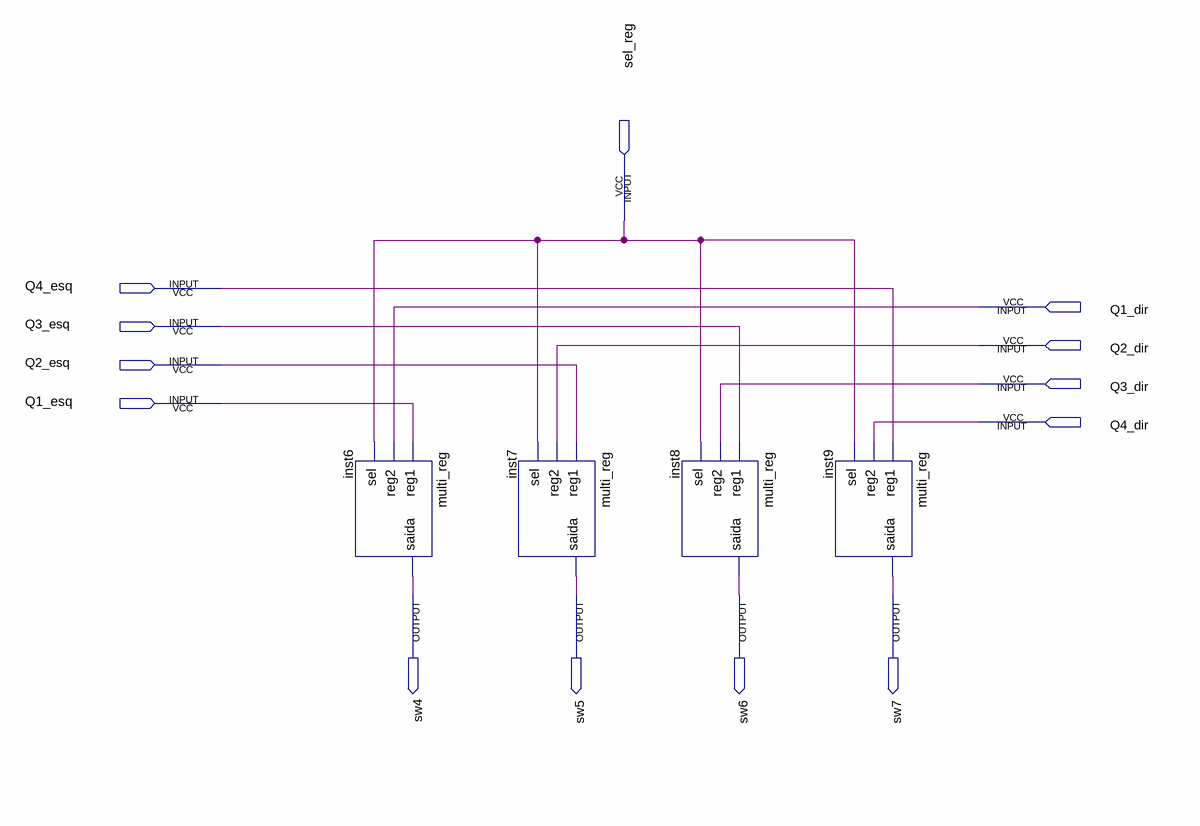
[diagram p0: schematic sheet]
// Quartus schematic ULA_in.bdf as structural Verilog: 4 symbols, 13 pins
module ULA_in (
  input  sel_reg,
  input  Q4_esq,
  input  Q1_dir,
  input  Q3_esq,
  input  Q2_dir,
  input  Q2_esq,
  input  Q3_dir,
  input  Q1_esq,
  input  Q4_dir,
  output sw4,
  output sw5,
  output sw6,
  output sw7
);

  multi_reg inst6 (.reg1(Q1_esq), .reg2(Q1_dir), .sel(sel_reg), .saida(sw4));
  multi_reg inst7 (.reg1(Q2_esq), .reg2(Q2_dir), .sel(sel_reg), .saida(sw5));
  multi_reg inst8 (.reg1(Q3_esq), .reg2(Q3_dir), .sel(sel_reg), .saida(sw6));
  multi_reg inst9 (.reg1(Q4_esq), .reg2(Q4_dir), .sel(sel_reg), .saida(sw7));
endmodule
